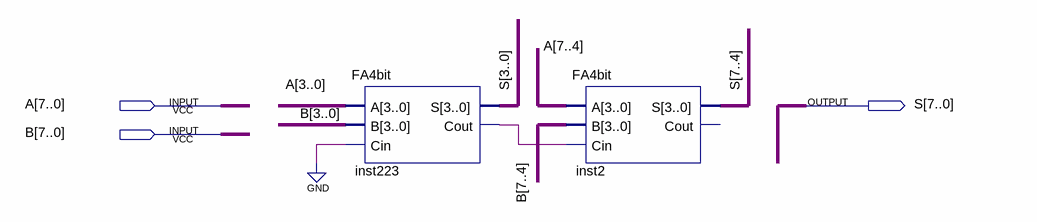
[diagram p0: schematic sheet]
// Quartus schematic FA8bit.bdf as structural Verilog: 2 symbols, 3 pins
module FA8bit (
  input  [7:0] A,
  input  [7:0] B,
  output [7:0] S
);

  wire inst223_cout;

  FA4bit inst223 (.A(A[3:0]), .B(B[3:0]), .Cin(1'b0), .S(S[3:0]), .Cout(inst223_cout));
  FA4bit inst2 (.A(A[7:4]), .B(B[7:4]), .Cin(inst223_cout), .S(S[7:4]));  // open: Cout
endmodule
